# EAGLE schematic demo1 (EAGLE 7.5.0)
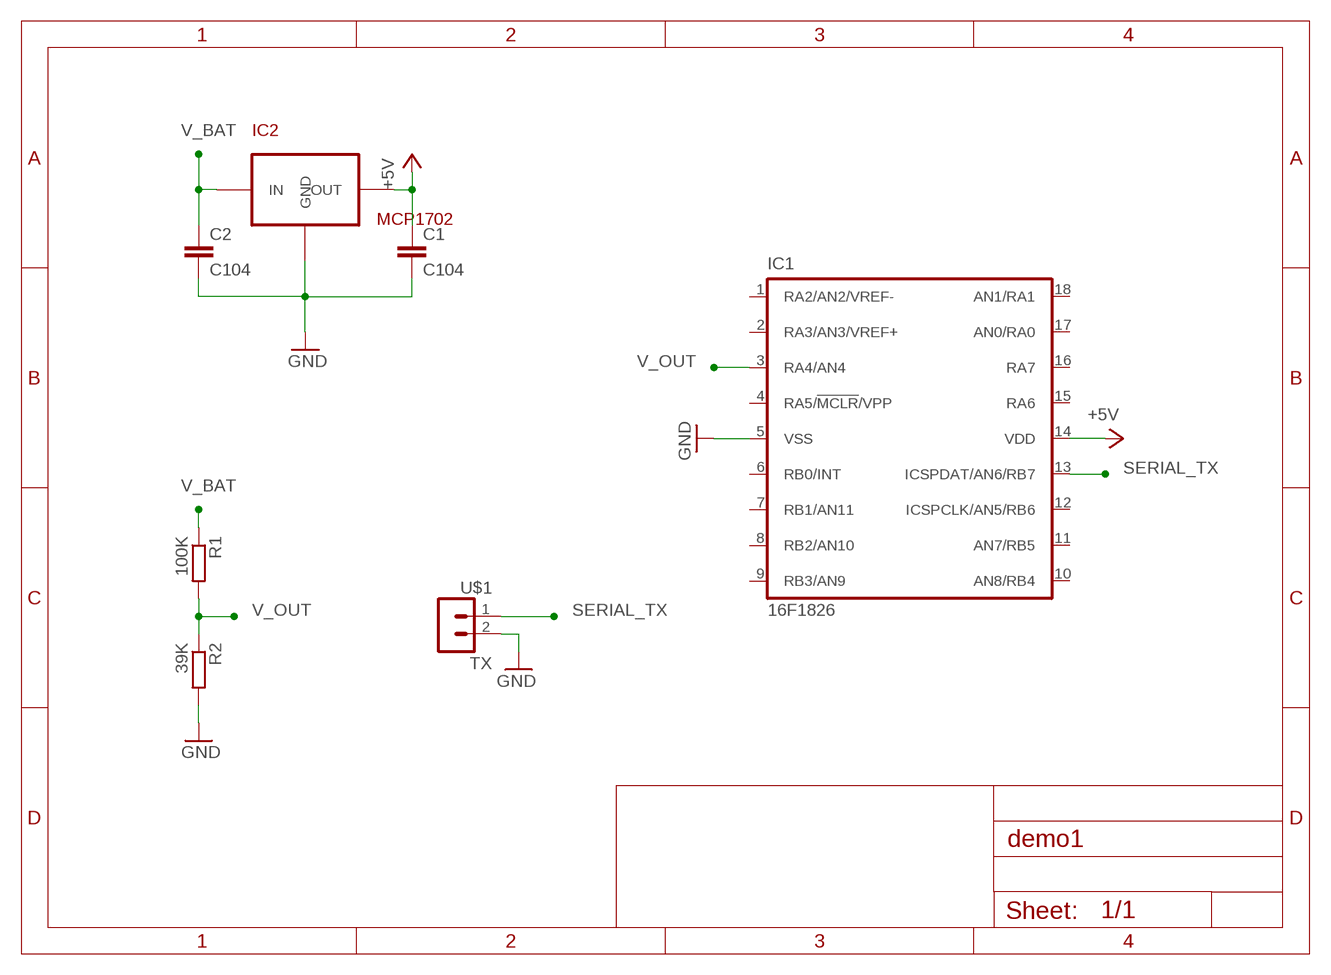
[diagram p0: schematic, sheet 1]

## Parts
C1  C104  COND_SMD0805  [0805]
C2  C104  COND_SMD0805  [0805]
IC1  16F1826  PIC16F1826-SO  [SO-18W]
IC2  MCP1702  MCP1700SOT89  [SOT-89]
R1  100K  RES_SMD-0805  [0805]
R2  39K  RES_SMD-0805  [0805]
U$1  TX  CON-2PH-LOCK  [PINHEAD-MALE-2H-LOCK]

## Nets
+5V: C1.1 IC1.14(VDD) IC2.3(OUT)
GND: C1.2 C2.2 IC1.5(VSS) IC2.1(GND) R2.2 U$1.2
SERIAL_TX: IC1.13(ICSPDAT/AN6/RB7) U$1.1
V_BAT: C2.1 IC2.2(IN) R1.1
V_OUT: IC1.3(RA4/AN4) R1.2 R2.1
Unconnected: IC1.1(RA2/AN2/VREF-) IC1.2(RA3/AN3/VREF+) IC1.4(RA5/!MCLR!/VPP) IC1.6(RB0/INT) IC1.7(RB1/AN11) IC1.8(RB2/AN10) IC1.9(RB3/AN9) IC1.10(AN8/RB4) IC1.11(AN7/RB5) IC1.12(ICSPCLK/AN5/RB6) IC1.15(RA6) IC1.16(RA7) IC1.17(AN0/RA0) IC1.18(AN1/RA1)

## Library data of the parts
C1 C2 = Marttyn:COND_SMD: Condensador modificado para poder pasar señales por debajo
IC1 = Marttyn:PIC16F1826
IC2 = Marttyn:MCP1700: Microchip Linear Vreg Vin max = 6v Vout = 1.2/1.8/2.5/3/3.3/5v Iout = 250mA Un condensador ceramico de 1uF a la entrada y otro a la salida es suficiente para estabilidad.
R1 R2 = Marttyn:RES_SMD
U$1 = Marttyn:CON-2P

## Net classes
0 default: width 0.254 mm
1 potencia-media: width 0.406 mm
2 potencia-alta: width 0.61 mm